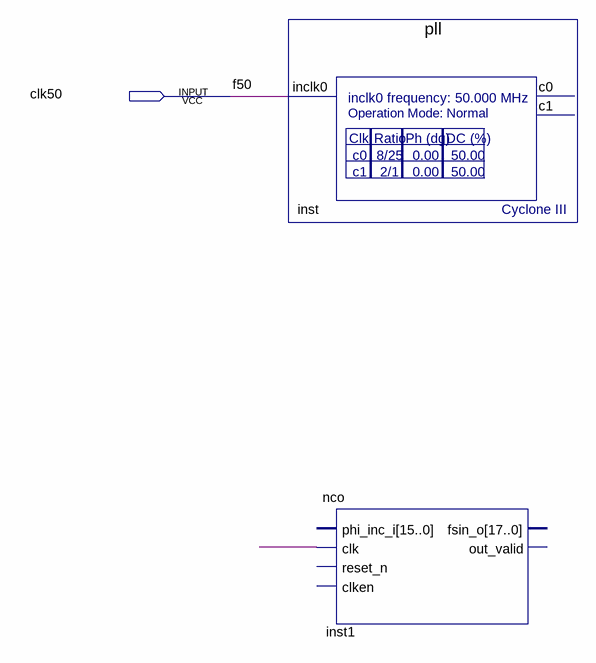
[diagram p0: schematic sheet]
// Quartus schematic usd_fpga.bdf as structural Verilog: 2 symbols, 1 pins
module usd_fpga (
  input  clk50
);

  wire undriven;

  pll inst (.inclk0(clk50));  // open: c0, c1
  nco inst1 (.clk(undriven));  // open: phi_inc_i, reset_n, clken, fsin_o, out_valid

  // Other names for the same wires on the sheet: f50 = clk50
endmodule
